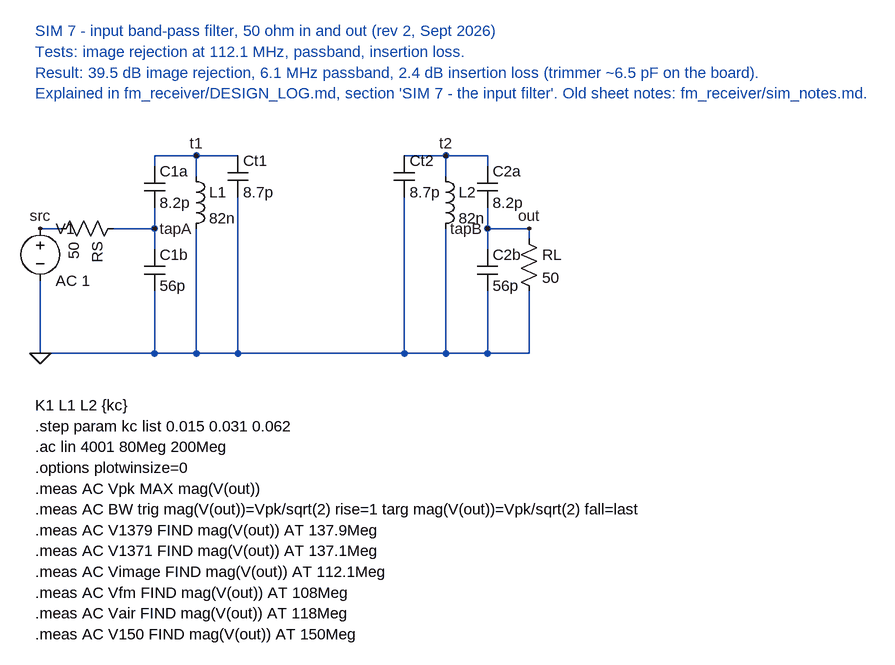
[diagram p0: schematic sim7_input_bpf.asc]
sim7_input_bpf.asc, the LTspice schematic file:
Version 4
SHEET 1 1200 900
WIRE 80 208 112 208
WIRE 192 208 256 208
WIRE 80 288 80 400
WIRE 256 96 320 96
WIRE 320 96 384 96
WIRE 256 96 256 112
WIRE 256 176 256 240
WIRE 256 304 256 400
WIRE 320 96 320 128
WIRE 320 208 320 400
WIRE 384 160 384 400
WIRE 640 96 704 96
WIRE 704 96 768 96
WIRE 640 160 640 400
WIRE 704 96 704 128
WIRE 704 208 704 400
WIRE 768 96 768 112
WIRE 768 176 768 240
WIRE 768 304 768 400
WIRE 768 208 832 208
WIRE 832 208 832 224
WIRE 832 304 832 400
WIRE 80 400 256 400
WIRE 256 400 320 400
WIRE 320 400 384 400
WIRE 384 400 640 400
WIRE 640 400 704 400
WIRE 704 400 768 400
WIRE 768 400 832 400
FLAG 80 400 0
FLAG 80 208 src
FLAG 256 208 tapA
FLAG 320 96 t1
FLAG 704 96 t2
FLAG 768 208 tapB
FLAG 832 208 out
SYMBOL voltage 80 192 R0
SYMATTR InstName V1
SYMATTR Value AC 1
SYMBOL res 208 192 R90
SYMATTR InstName RS
SYMATTR Value 50
SYMBOL cap 240 112 R0
SYMATTR InstName C1a
SYMATTR Value 8.2p
SYMBOL cap 240 240 R0
SYMATTR InstName C1b
SYMATTR Value 56p
SYMBOL ind 304 112 R0
SYMATTR InstName L1
SYMATTR Value 82n
SYMATTR SpiceLine Rser=0.47
SYMBOL cap 368 96 R0
SYMATTR InstName Ct1
SYMATTR Value 8.7p
SYMBOL cap 624 96 R0
SYMATTR InstName Ct2
SYMATTR Value 8.7p
SYMBOL ind 688 112 R0
SYMATTR InstName L2
SYMATTR Value 82n
SYMATTR SpiceLine Rser=0.47
SYMBOL cap 752 112 R0
SYMATTR InstName C2a
SYMATTR Value 8.2p
SYMBOL cap 752 240 R0
SYMATTR InstName C2b
SYMATTR Value 56p
SYMBOL res 816 208 R0
SYMATTR InstName RL
SYMATTR Value 50
TEXT 72 480 Left 2 !K1 L1 L2 {kc}
TEXT 72 512 Left 2 !.step param kc list 0.015 0.031 0.062
TEXT 72 544 Left 2 !.ac lin 4001 80Meg 200Meg
TEXT 72 576 Left 2 !.options plotwinsize=0
TEXT 72 608 Left 2 !.meas AC Vpk MAX mag(V(out))
TEXT 72 640 Left 2 !.meas AC BW trig mag(V(out))=Vpk/sqrt(2) rise=1 targ mag(V(out))=Vpk/sqrt(2) fall=last
TEXT 72 672 Left 2 !.meas AC V1379 FIND mag(V(out)) AT 137.9Meg
TEXT 72 704 Left 2 !.meas AC V1371 FIND mag(V(out)) AT 137.1Meg
TEXT 72 736 Left 2 !.meas AC Vimage FIND mag(V(out)) AT 112.1Meg
TEXT 72 768 Left 2 !.meas AC Vfm FIND mag(V(out)) AT 108Meg
TEXT 72 800 Left 2 !.meas AC Vair FIND mag(V(out)) AT 118Meg
TEXT 72 832 Left 2 !.meas AC V150 FIND mag(V(out)) AT 150Meg
TEXT 72 -96 Left 2 ;SIM 7 - input band-pass filter, 50 ohm in and out (rev 2, Sept 2026)
TEXT 72 -64 Left 2 ;Tests: image rejection at 112.1 MHz, passband, insertion loss.
TEXT 72 -32 Left 2 ;Result: 39.5 dB image rejection, 6.1 MHz passband, 2.4 dB insertion loss (trimmer ~6.5 pF on the board).
TEXT 72 0 Left 2 ;Explained in fm_receiver/DESIGN_LOG.md, section 'SIM 7 - the input filter'. Old sheet notes: fm_receiver/sim_notes.md.

The netlist it stands for:
* sim7_input_bpf.asc
V1 src 0 AC 1
RS tapA src 50
C1a t1 tapA 8.2p
C1b tapA 0 56p
L1 t1 0 82n Rser=0.47
Ct1 t1 0 8.7p
Ct2 t2 0 8.7p
L2 t2 0 82n Rser=0.47
C2a t2 out 8.2p
C2b out 0 56p
RL out 0 50
K1 L1 L2 {kc}
.step param kc list 0.015 0.031 0.062
.ac lin 4001 80Meg 200Meg
.options plotwinsize=0
.meas AC Vpk MAX mag(V(out))
.meas AC BW trig mag(V(out))=Vpk/sqrt(2) rise=1 targ mag(V(out))=Vpk/sqrt(2) fall=last
.meas AC V1379 FIND mag(V(out)) AT 137.9Meg
.meas AC V1371 FIND mag(V(out)) AT 137.1Meg
.meas AC Vimage FIND mag(V(out)) AT 112.1Meg
.meas AC Vfm FIND mag(V(out)) AT 108Meg
.meas AC Vair FIND mag(V(out)) AT 118Meg
.meas AC V150 FIND mag(V(out)) AT 150Meg
* SIM 7 - input band-pass filter, 50 ohm in and out (rev 2, Sept 2026)
* Tests: image rejection at 112.1 MHz, passband, insertion loss.
* Result: 39.5 dB image rejection, 6.1 MHz passband, 2.4 dB insertion loss (trimmer ~6.5 pF on the board).
* Explained in fm_receiver/DESIGN_LOG.md, section 'SIM 7 - the input filter'. Old sheet notes: fm_receiver/sim_notes.md.
.backanno
.end